# EAGLE design EEGFrontOnly (EAGLE 8.6.0)

## Sheet 1 of 2
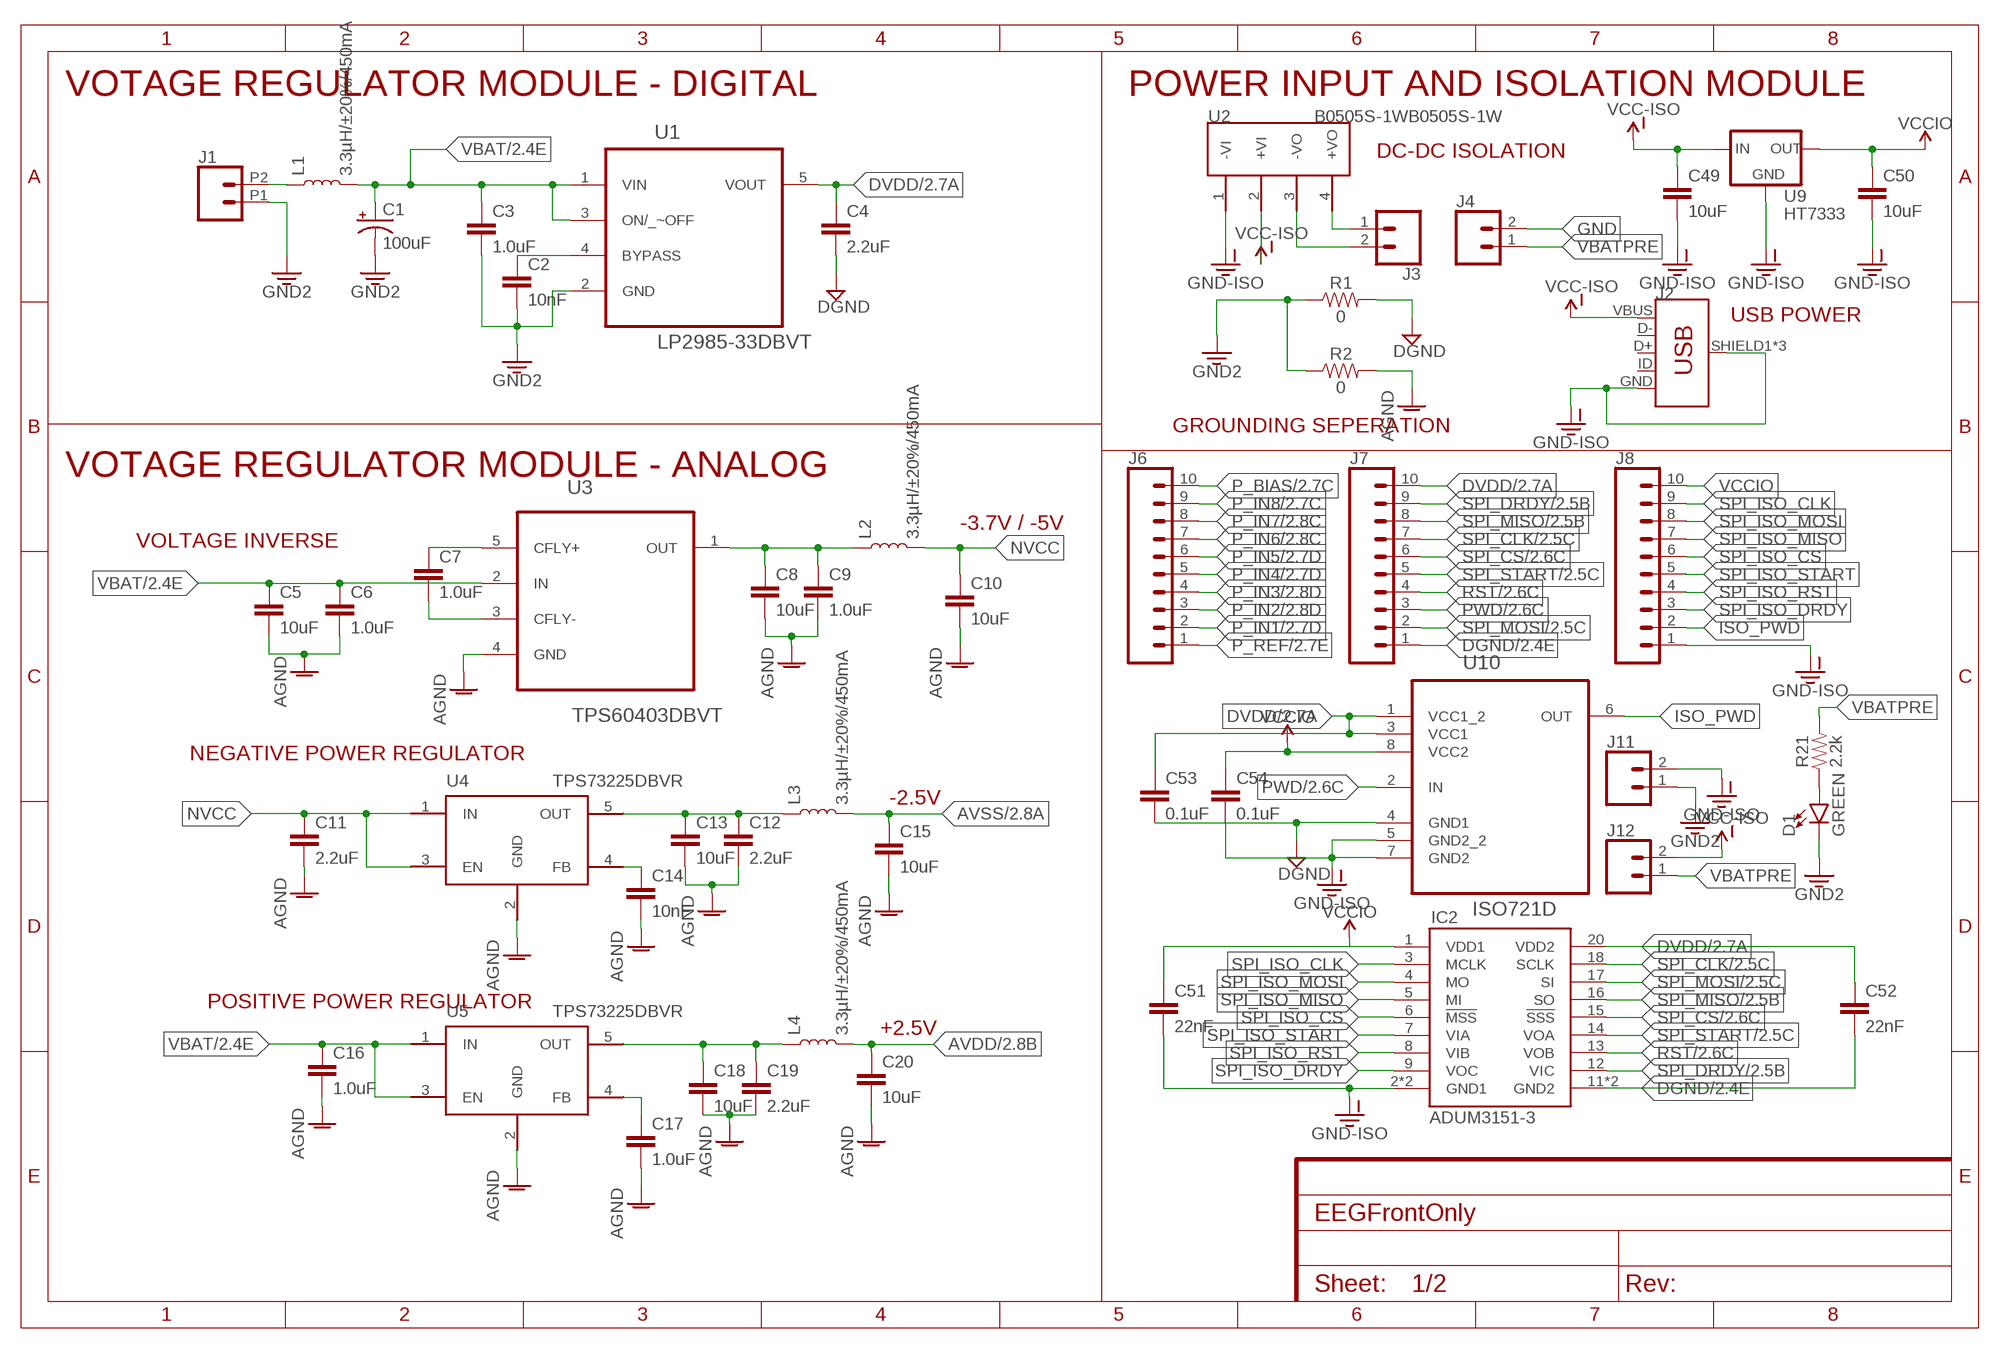
[diagram p0: schematic, sheet 1]

### Parts
C1  100uF  100UF-POLAR-RADIAL-2.5MM-25V-20%  [CPOL-RADIAL-2.5MM-6.5MM]
C2  10nF  10NF-0402-50V-10%  [0402]
C3  1.0uF  1.0UF-0402-16V-10%  [0402]
C4  2.2uF  2.2UF-0603-10V-20%  [0603]
C5  10uF  10UF-0603-6.3V-20%  [0603]
C6  1.0uF  1.0UF-0603-16V-10%  [0603]
C7  1.0uF  1.0UF-0402-16V-10%  [0402]
C8  10uF  10UF-0603-6.3V-20%  [0603]
C9  1.0uF  1.0UF-0603-16V-10%  [0603]
C10  10uF  10UF-0603-6.3V-20%  [0603]
C11  2.2uF  2.2UF-0603-10V-20%  [0603]
C12  2.2uF  2.2UF-0603-10V-20%  [0603]
C13  10uF  10UF-0603-6.3V-20%  [0603]
C14  10nF  10NF-0402-50V-10%  [0402]
C15  10uF  10UF-0603-6.3V-20%  [0603]
C16  1.0uF  1.0UF-0402-16V-10%  [0402]
C17  1.0uF  1.0UF-0402-16V-10%  [0402]
C18  10uF  10UF-0603-6.3V-20%  [0603]
C19  2.2uF  2.2UF-0603-10V-20%  [0603]
C20  10uF  10UF-0603-6.3V-20%  [0603]
C49  10uF  10UF-0603-6.3V-20%  [0603]
C50  10uF  10UF-0603-6.3V-20%  [0603]
C51  22nF  22NF/22,000PF-0402-50V-10%  [0402]
C52  22nF  22NF/22,000PF-0402-50V-10%  [0402]
C53  0.1uF  0.1UF-0402-16V-10%  [0402]
C54  0.1uF  0.1UF-0402-16V-10%  [0402]
D1  GREEN  LED-GREEN0603  [LED-0603]
IC2  ADUM3151-3  [SSOP20]
J1  CONN_022.54MM_SCREWTERM  [1X02_2.54_SCREWTERM]
J2  USB_MICRO-BREDUCED_PASTE  [USB-B-MICRO-SMD_RED_PASTE]
J3  CONN_02  [1X02]
J4  CONN_02  [1X02]
J6  CONN_10"  [1X10]
J7  CONN_10"  [1X10]
J8  CONN_10"  [1X10]
J11  CONN_02  [1X02]
J12  CONN_02  [1X02]
L1  3.3µH/±20%/450mA  INDUCTOR-0805-3.3UH  [0805]
L2  3.3µH/±20%/450mA  INDUCTOR-0805-3.3UH  [0805]
L3  3.3µH/±20%/450mA  INDUCTOR-0805-3.3UH  [0805]
L4  3.3µH/±20%/450mA  INDUCTOR-0805-3.3UH  [0805]
R1  0  560OHM_0402_1%  [0402]
R2  0  560OHM_0402_1%  [0402]
R21  2.2k  2.2KOHM-0603-1/10W-1%  [0603]
U1  LP2985-33DBVT  [SOT95P280X145-5N]
U2  B0505S-1WB0505S-1W  [DIP4]
U3  TPS60403DBVT  [SOT95P280X145-5N]
U4  TPS73225DBVR  [SOT95P280X145-5N]
U5  TPS73225DBVR  [SOT95P280X145-5N]
U9  HT7333  [SOT-89]
U10  ISO721D  [SOIC127P600X175-8N]

### Nets
AGND: C5.2 C6.2 C8.2 C9.2 C10.2 C11.2 C12.2 C13.2 C14.2 C15.2 C16.2 C17.2 C18.2 C19.2 C20.2 R2.2 U3.4(GND) U4.2(GND) U5.2(GND) ; also sheet 2
AVDD: C20.1 L4.2 ; also sheet 2
AVSS: C15.1 L3.2 ; also sheet 2
BYPASS: C2.1 U1.4(BYPASS)
DGND: C4.2 C52.2 C53.2 IC2.11(GND2) IC2.19(GND2) J7.1 R1.2 U10.4(GND1) ; also sheet 2
DVDD: C4.1 C52.1 C53.1 IC2.20(VDD2) J7.10 U1.5(VOUT) U10.1(VCC1_2) U10.3(VCC1) ; also sheet 2
GND: C1.2(-) C2.2 C3.2 D1.C J1.P1 J4.2 J11.1 R1.1 R2.1 U1.2(GND) ; supply symbol labelled GND2
GND-ISO: C49.2 C50.2 C51.2 C54.2 IC2.2(GND1) IC2.10(GND1) J2.GND J2.SHIELD1(SHIELD) J2.SHIELD2(SHIELD) J2.SHIELD3(SHIELD) J8.1 J11.2 U2.1(-VI) U9.2(GND) U10.5(GND2_2) U10.7(GND2)
ISO_PWD: J8.2 U10.6(OUT)
N$1: J3.1 U2.4(+VO)
N$2: J3.2 U2.3(-VO)
N$3: C7.1 U3.5(CFLY+)
N$4: C7.2 U3.3(CFLY-)
N$5: C8.1 C9.1 L2.1 U3.1(OUT)
N$6: C17.1 U5.4(FB)
N$7: C12.1 C13.1 L3.1 U4.5(OUT)
N$8: C14.1 U4.4(FB)
N$9: C18.1 C19.1 L4.1 U5.5(OUT)
N$27: D1.A R21.1
NVCC: C10.1 C11.1 L2.2 U4.1(IN) U4.3(EN)
P_BIAS: J6.10 ; also sheet 2
P_IN1: J6.2 ; also sheet 2
P_IN2: J6.3 ; also sheet 2
P_IN3: J6.4 ; also sheet 2
P_IN4: J6.5 ; also sheet 2
P_IN5: J6.6 ; also sheet 2
P_IN6: J6.7 ; also sheet 2
P_IN7: J6.8 ; also sheet 2
P_IN8: J6.9 ; also sheet 2
P_REF: J6.1 ; also sheet 2
PWD: J7.3 U10.2(IN) ; also sheet 2
RST: IC2.13(VOB) J7.4 ; also sheet 2
SPI_CLK: IC2.18(SCLK) J7.7 ; also sheet 2
SPI_CS: IC2.15(!SSS) J7.6 ; also sheet 2
SPI_DRDY: IC2.12(VIC) J7.9 ; also sheet 2
SPI_ISO_CLK: IC2.3(MCLK) J8.9
SPI_ISO_CS: IC2.6(!MSS) J8.6
SPI_ISO_DRDY: IC2.9(VOC) J8.3
SPI_ISO_MISO: IC2.5(MI) J8.7
SPI_ISO_MOSI: IC2.4(MO) J8.8
SPI_ISO_RST: IC2.8(VIB) J8.4
SPI_ISO_START: IC2.7(VIA) J8.5
SPI_MISO: IC2.16(SO) J7.8 ; also sheet 2
SPI_MOSI: IC2.17(SI) J7.2 ; also sheet 2
SPI_START: IC2.14(VOA) J7.5 ; also sheet 2
VBAT: C1.1(+) C3.1 C5.1 C6.1 C16.1 L1.2 U1.1(VIN) U1.3(ON/_~OFF) U3.2(IN) U5.1(IN) U5.3(EN) ; also sheet 2
VBATPRE: J1.P2 J4.1 J12.1 L1.1 R21.2
VCC-ISO: C49.1 J2.VBUS J12.2 U2.2(+VI) U9.3(IN) U9.4(IN)
VCCIO: C50.1 C51.1 C54.1 IC2.1(VDD1) J8.10 U9.1(OUT) U10.8(VCC2)
Unconnected: J2.D+ J2.D- J2.ID

### Notes on the sheet
- VOTAGE REGULATOR MODULE - DIGITAL | POWER INPUT AND ISOLATION MODULE
- DC-DC ISOLATION
- USB POWER
- GROUNDING SEPERATION
- VOTAGE REGULATOR MODULE - ANALOG
- -3.7V / -5V
- VOLTAGE INVERSE
- NEGATIVE POWER REGULATOR
- -2.5V
- POSITIVE POWER REGULATOR
- +2.5V

## Sheet 2 of 2
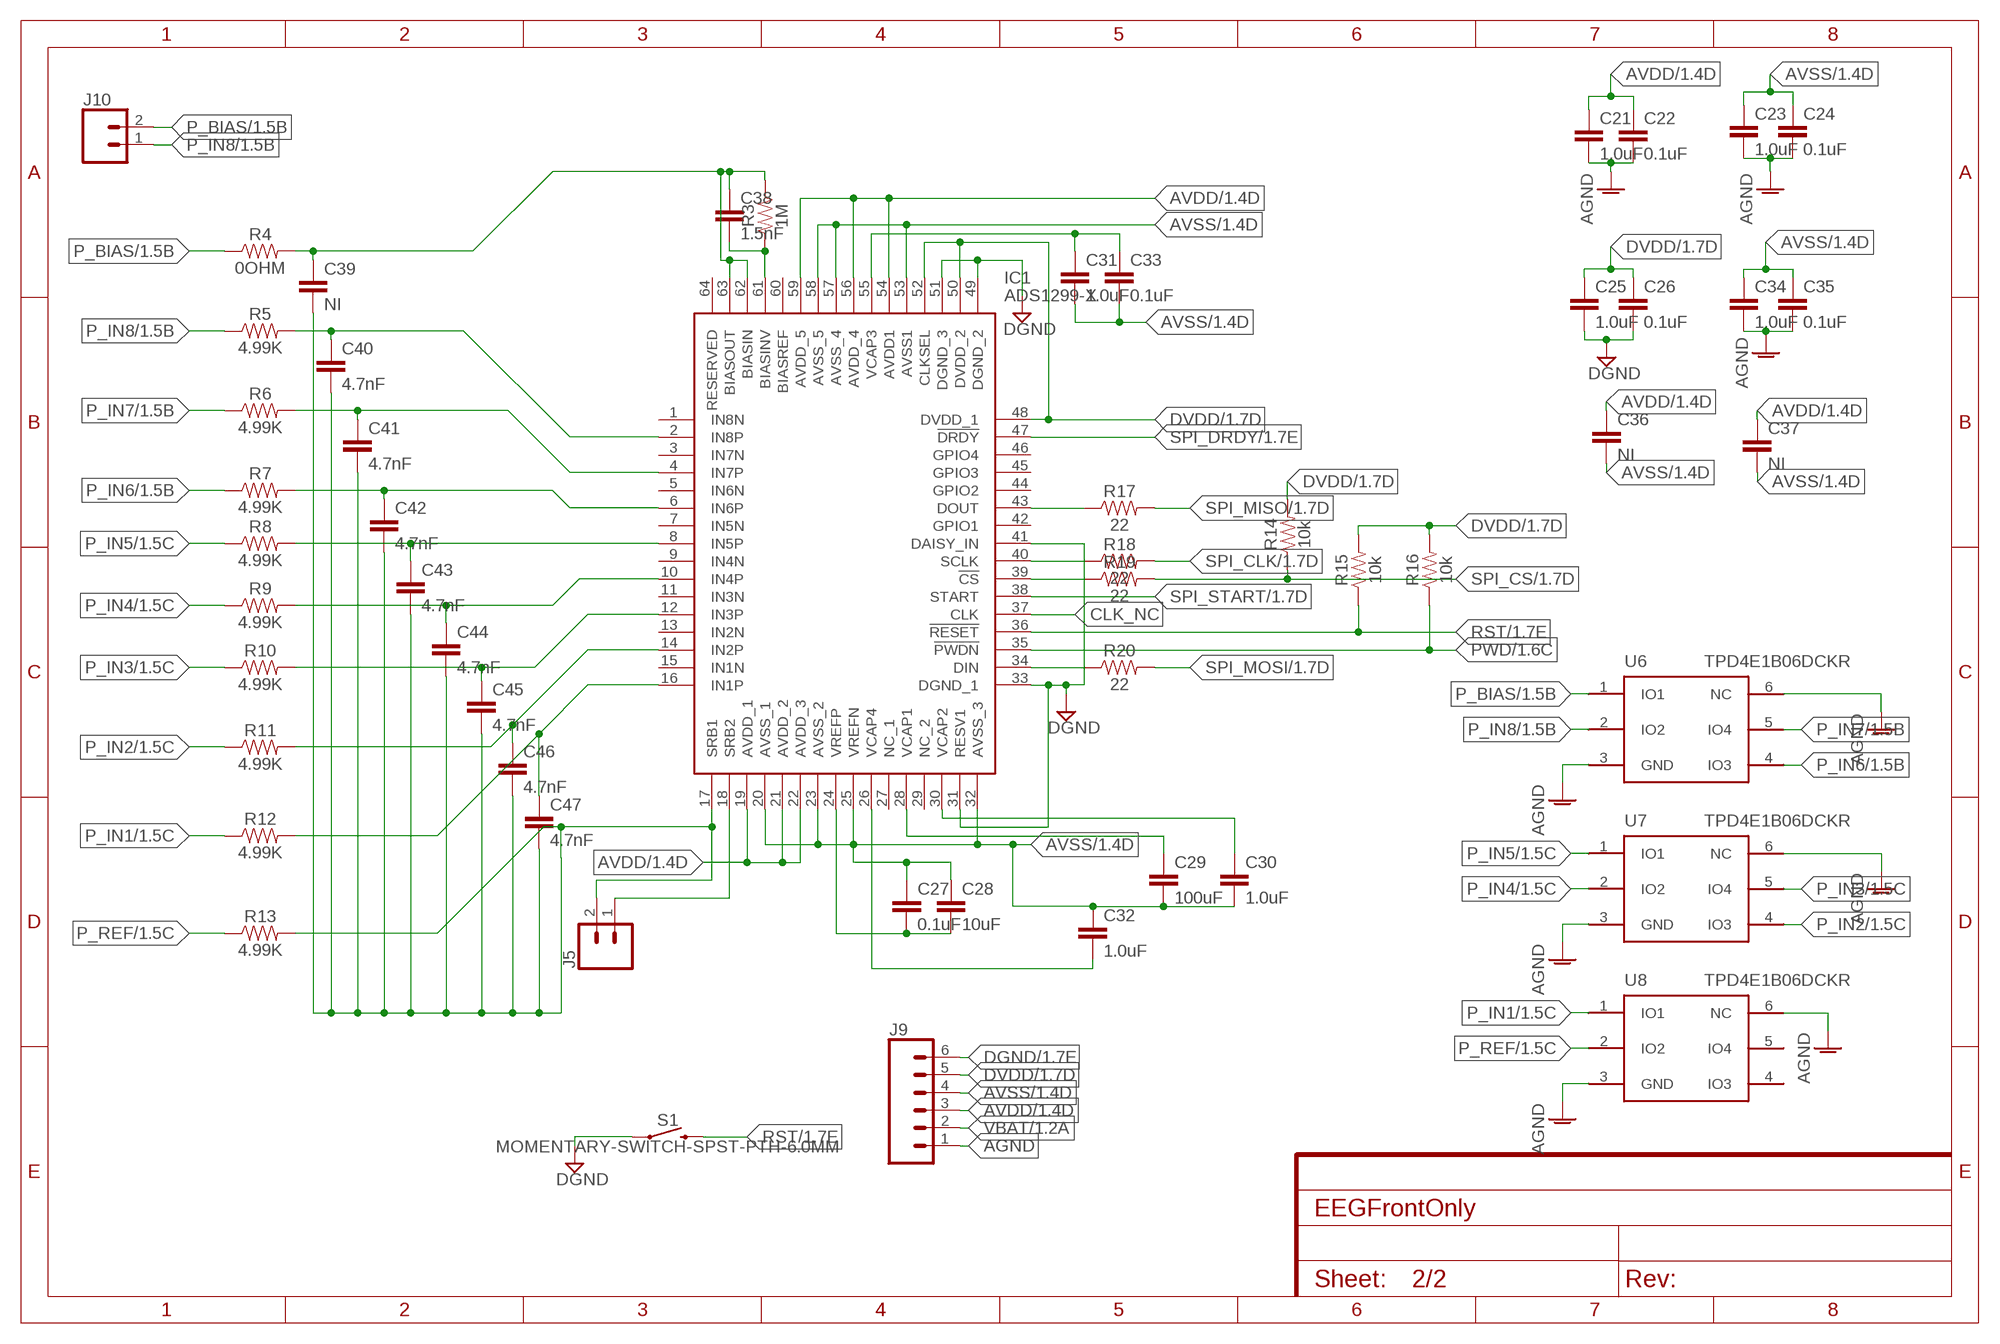
[diagram p1: schematic, sheet 2]

### Parts
C21  1.0uF  1.0UF-0402-16V-10%  [0402]
C22  0.1uF  0.1UF-0402-16V-10%  [0402]
C23  1.0uF  1.0UF-0402-16V-10%  [0402]
C24  0.1uF  0.1UF-0402-16V-10%  [0402]
C25  1.0uF  1.0UF-0402-16V-10%  [0402]
C26  0.1uF  0.1UF-0402-16V-10%  [0402]
C27  0.1uF  0.1UF-0402-16V-10%  [0402]
C28  10uF  10UF-0402-6.3V-20%  [0402]
C29  100uF  100UF-1210-20%-10V  [1210]
C30  1.0uF  1.0UF-0402-16V-10%  [0402]
C31  1.0uF  1.0UF-0402-16V-10%  [0402]
C32  1.0uF  1.0UF-0402-16V-10%  [0402]
C33  0.1uF  0.1UF-0402-16V-10%  [0402]
C34  1.0uF  1.0UF-0402-16V-10%  [0402]
C35  0.1uF  0.1UF-0402-16V-10%  [0402]
C36  NI  0.1UF-0402-16V-10%  [0402]
C37  NI  0.1UF-0402-16V-10%  [0402]
C38  1.5nF  1.5NF-0402  [0402]
C39  NI  4.7NF-0402  [0402]
C40  4.7nF  4.7NF-0402  [0402]
C41  4.7nF  4.7NF-0402  [0402]
C42  4.7nF  4.7NF-0402  [0402]
C43  4.7nF  4.7NF-0402  [0402]
C44  4.7nF  4.7NF-0402  [0402]
C45  4.7nF  4.7NF-0402  [0402]
C46  4.7nF  4.7NF-0402  [0402]
C47  4.7nF  4.7NF-0402  [0402]
IC1  ADS1299-X  [QFP50P1200X1200X120-64N]
J5  CONN_02  [1X02]
J9  CONN_06SILK_FEMALE_PTH  [1X06]
J10  CONN_02  [1X02]
R3  1M  1MOHM-0402-1/4W-5%  [0402]
R4  0OHM  [0402]
R5  4.99K  4.99KOHM-0402  [0402]
R6  4.99K  4.99KOHM-0402  [0402]
R7  4.99K  4.99KOHM-0402  [0402]
R8  4.99K  4.99KOHM-0402  [0402]
R9  4.99K  4.99KOHM-0402  [0402]
R10  4.99K  4.99KOHM-0402  [0402]
R11  4.99K  4.99KOHM-0402  [0402]
R12  4.99K  4.99KOHM-0402  [0402]
R13  4.99K  4.99KOHM-0402  [0402]
R14  10k  10KOHM-0402-1/10W-1%  [0402]
R15  10k  10KOHM-0402-1/10W-1%  [0402]
R16  10k  10KOHM-0402-1/10W-1%  [0402]
R17  22  22OHM-0402-1/10W-1%  [0402]
R18  22  22OHM-0402-1/10W-1%  [0402]
R19  22  22OHM-0402-1/10W-1%  [0402]
R20  22  22OHM-0402-1/10W-1%  [0402]
S1  MOMENTARY-SWITCH-SPST-PTH-6.0MM  [TACTILE_SWITCH_PTH_6.0MM]
U6  TPD4E1B06DCKR  [SC70-6]
U7  TPD4E1B06DCKR  [SC70-6]
U8  TPD4E1B06DCKR  [SC70-6]

### Nets
AGND: C21.2 C22.2 C23.2 C24.2 C34.2 C35.2 J9.1 U6.3(GND) U6.6(NC) U7.3(GND) U7.6(NC) U8.3(GND) U8.6(NC) ; also sheet 1
AVDD: C21.1 C22.1 C36.1 C37.1 IC1.19(AVDD_1) IC1.21(AVDD_2) IC1.22(AVDD_3) IC1.54(AVDD1) IC1.56(AVDD_4) IC1.59(AVDD_5) J9.3 ; also sheet 1
AVSS: C23.1 C24.1 C27.1 C28.1 C29.2 C30.2 C31.2 C32.1 C33.2 C34.1 C35.1 C36.2 C37.2 IC1.20(AVSS_1) IC1.23(AVSS_2) IC1.25(VREFN) IC1.32(AVSS_3) IC1.53(AVSS1) IC1.57(AVSS_4) IC1.58(AVSS_5) J9.4 ; also sheet 1
CLK_NC: IC1.37(CLK)
DGND: C25.2 C26.2 IC1.31(RESV1) IC1.33(DGND_1) IC1.41(DAISY_IN) IC1.49(DGND_2) IC1.51(DGND_3) J9.6 S1.1 ; also sheet 1
DVDD: C25.1 C26.1 IC1.48(DVDD_1) IC1.50(DVDD_2) IC1.52(CLKSEL) J9.5 R14.2 R15.2 R16.2 ; also sheet 1
N$10: C27.2 C28.2 IC1.24(VREFP)
N$11: IC1.18(SRB2) J5.1
N$12: C39.2 C40.2 C41.2 C42.2 C43.2 C44.2 C45.2 C46.2 C47.2 IC1.17(SRB1) J5.2 R13.2
N$13: C38.2 IC1.61(BIASINV) R3.1
N$14: C38.1 C39.1 IC1.62(BIASIN) IC1.63(BIASOUT) R3.2 R4.2
N$15: C40.1 IC1.2(IN8P) R5.2
N$16: C41.1 IC1.4(IN7P) R6.2
N$17: C42.1 IC1.6(IN6P) R7.2
N$18: C43.1 IC1.8(IN5P) R8.2
N$19: C44.1 IC1.10(IN4P) R9.2
N$20: C45.1 IC1.12(IN3P) R10.2
N$21: C46.1 IC1.14(IN2P) R11.2
N$22: C47.1 IC1.16(IN1P) R12.2
N$23: IC1.43(DOUT) R17.1
N$24: IC1.40(SCLK) R18.1
N$25: IC1.39(!CS) R19.1
N$26: IC1.34(DIN) R20.1
P_BIAS: J10.2 R4.1 U6.1(IO1) ; also sheet 1
P_IN1: R12.1 U8.1(IO1) ; also sheet 1
P_IN2: R11.1 U7.4(IO3) ; also sheet 1
P_IN3: R10.1 U7.5(IO4) ; also sheet 1
P_IN4: R9.1 U7.2(IO2) ; also sheet 1
P_IN5: R8.1 U7.1(IO1) ; also sheet 1
P_IN6: R7.1 U6.4(IO3) ; also sheet 1
P_IN7: R6.1 U6.5(IO4) ; also sheet 1
P_IN8: J10.1 R5.1 U6.2(IO2) ; also sheet 1
P_REF: R13.1 U8.2(IO2) ; also sheet 1
PWD: IC1.35(!PWDN) R16.1 ; also sheet 1
RST: IC1.36(!RESET) R15.1 S1.3 ; also sheet 1
SPI_CLK: R18.2 ; also sheet 1
SPI_CS: R14.1 R19.2 ; also sheet 1
SPI_DRDY: IC1.47(!DRDY) ; also sheet 1
SPI_MISO: R17.2 ; also sheet 1
SPI_MOSI: R20.2 ; also sheet 1
SPI_START: IC1.38(START) ; also sheet 1
VBAT: J9.2 ; also sheet 1
VCAP1: C29.1 IC1.28(VCAP1)
VCAP2: C30.1 IC1.30(VCAP2)
VCAP3: C31.1 C33.1 IC1.55(VCAP3)
VCAP4: C32.2 IC1.26(VCAP4)
Unconnected: IC1.1(IN8N) IC1.3(IN7N) IC1.5(IN6N) IC1.7(IN5N) IC1.9(IN4N) IC1.11(IN3N) IC1.13(IN2N) IC1.15(IN1N) IC1.27(NC_1) IC1.29(NC_2) IC1.42(GPIO1) IC1.44(GPIO2) IC1.45(GPIO3) IC1.46(GPIO4) IC1.60(BIASREF) IC1.64(RESERVED) U8.4(IO3) U8.5(IO4)

## Library data of the parts
C1 = SparkFun-Capacitors:100UF-POLAR: 100µF polarized capacitors A capacitor is a passive two-terminal electrical component used to store electrical energy temporarily in an electric field.; PROD_ID: CAP-08439
C2 C14 = SparkFun-Capacitors:10NF: 0.01uF/10nF/10,000pF ceramic capacitors A capacitor is a passive two-terminal electrical component used to store electrical energy temporarily in an electric field. CAP-09321
C3 C7 C16 C17 C21 C23 C25 C30-C32 C34 = SparkFun-Capacitors:1.0UF: 1µF ceramic capacitors A capacitor is a passive two-terminal electrical component used to store electrical energy temporarily in an electric field.; PROD_ID: CAP-12417
C4 C11 C12 C19 = SparkFun-Capacitors:2.2UF: 2.2µF ceramic capacitors A capacitor is a passive two-terminal electrical component used to store electrical energy temporarily in an electric field.; PROD_ID: CAP-07888
C5 C8 C10 C13 C15 C18 C20 C49 C50 = SparkFun-Capacitors:10UF: 10.0µF ceramic capacitors A capacitor is a passive two-terminal electrical component used to store electrical energy temporarily in an electric field.; PROD_ID: CAP-11015
C6 C9 = SparkFun-Capacitors:1.0UF: 1µF ceramic capacitors A capacitor is a passive two-terminal electrical component used to store electrical energy temporarily in an electric field.; PROD_ID: CAP-00868
C22 C24 C26 C27 C33 C35 C53 C54 = SparkFun-Capacitors:0.1UF: 0.1µF ceramic capacitors A capacitor is a passive two-terminal electrical component used to store electrical energy temporarily in an electric field.; PROD_ID: CAP-12416
C28 = SparkFun-Capacitors:10UF: 10.0µF ceramic capacitors A capacitor is a passive two-terminal electrical component used to store electrical energy temporarily in an electric field.
C29 = jingjieparts:100UF
C36 C37 = SparkFun-Capacitors:0.1UF: 0.1µF ceramic capacitors A capacitor is a passive two-terminal electrical component used to store electrical energy temporarily in an electric field.; PROD_ID: CAP-12416; VALUE: 0.1uF
C38 = SparkFun-Capacitors:1.5NF
C39 = SparkFun-Capacitors:4.7NF; VALUE: 4.7nF
C40-C47 = SparkFun-Capacitors:4.7NF
C51 C52 = SparkFun-Capacitors:22NF/22,000PF: 0.022uF/22nF/22,000pF ceramic capacitors A capacitor is a passive two-terminal electrical component used to store electrical energy temporarily in an electric field.; PROD_ID: C337699
D1 = SparkFun-LED:LED-GREEN: Green SMD LED Used in manufacturing of various products at SparkFun Packages: 0603 - SMD 0603 package [Product Link] <http://www.futureelectronics.com/en/technologies/semiconductors/optoelectronics/leds/Pages/9894312-LTST-C190GKT.aspx?CrossPart=HSMG-C190&IM=0> LilyPad 1206 - SMD1206 LilyPad package [Product Link] <http://www.futureelectronics.com/en/Technologies/Product.aspx?ProductID=IN150NGHARVATEKCORPORATION2049943&IM=0> 1206 - SMD1206 package [Product Link] <http://www.futureelectronics.com/en/technologies/semiconductors/optoelectronics/leds/Pages/8315665-LTST-C150KGKT.aspx?IM=0> 1206 Bottom Mount -SMD 1206 Bottom Mount [Product Link] <http://www.digikey.com/product-detail/en/lite-on-inc/LTST-C230KGKT/160-1456-1-ND/386854> SparkFun Products: Pro Mini 328 -5V <https://www.sparkfun.com/products/821> RedBoard <https://www.sparkfun.com/products/12757> MP3 Trigger <https://www.sparkfun.com/products/13720> Makey Makey <https://www.sparkfun.com/products/11076>; PROD_ID: DIO-00821
IC1 = ADS1299-X:ADS1299-X: ADS1299-x 24-Bit Analog-to-Digital Converters (ADCs) Source: Datasheet <http://www.ti.com/lit/ds/symlink/ads1299.pdf>; DESCRIPTION: ADS1299-x 24-Bit Analog-to-Digital Converters (ADCs); HEIGHT: 1.2mm; MANUFACTURER_NAME: Texas Instruments; MANUFACTURER_PART_NUMBER: ADS1299-X
IC2 = analog-devices-adum315x:ADUM3151-3: The ADuM3151/ADuM3152/ADuM3153are 7-channel, SPIsolator™ digital isolators optimized for isolated serial peripheral interfaces (SPIs). Based on the Analog Devices, Inc., iCoupler® chip scale transformer technology, the low propagation delay in the CLK, MO/SI, MI/SO, and SSSPI bus signals supports SPI clock rates of up to 17 MHz. These channels operate with 14 ns propagation delay and 1 ns jitter to optimize timing for SPI. The library has been designed by Richard Magdycz <https://www.facebook.com/groups/eaglecadsoftUK>
J1 J3-J5 J10-J12 = SparkFun-Connectors:CONN_02: Multi connection point. Often used as Generic Header-pin footprint for 0.1 inch spaced/style header connections On any of the 0.1 inch spaced packages, you can populate with these: Break Away Headers - Straight <https://www.sparkfun.com/products/116> (PRT-00116) Break Away Male Headers - Right Angle <https://www.sparkfun.com/products/553> (PRT-00553) Female Headers <https://www.sparkfun.com/products/115> (PRT-00115) Break Away Headers - Machine Pin <https://www.sparkfun.com/products/117> (PRT-00117) Break Away Female Headers - Swiss Machine Pin <https://www.sparkfun.com/products/743> (PRT-00743) For SCREWTERMINALS and SPRING TERMINALS visit here: Screw Terimnals on SparkFun.com <https://www.sparkfun.com/search/results?term=Screw+Terminals> (5mm/3.5mm/2.54mm spacing) This device is also useful as a general connection point to wire up your design to another part of your project. Our various solder wires solder well into these plated through hole pads. Hook-Up Wire - Assortment (Stranded, 22 AWG) <https://www.sparkfun.com/products/11375> (PRT-11375) Hook-Up Wire - Assortment (Solid Core, 22 AWG) <https://www.sparkfun.com/products/11367> (PRT-11367) View the entire wire category on our website here <https://www.sparkfun.com/categories/141> Special notes: Molex polarized connector foot print use with: PRT-08233 with associated crimp pins and housings. 2.54_SCREWTERM for use with PRT-10571. 3.5mm Screw Terminal footprints for PRT-08084 5mm Screw Terminal footprints for use with PRT-08432
J2 = SparkFun-Connectors:USB_MICRO-B: USB Type Micro-B Connector Male/female and PTH/SMT variants SparkFun Products: SparkFun microB USB Breakout <https://www.sparkfun.com/products/12035> SparkFun USB microB Plug Breakout <https://www.sparkfun.com/products/10031> SparkFun ESP8266 Thing <https://www.sparkfun.com/products/13231>; PROD_ID: CONN-11752
J6-J8 = SparkFun-Connectors:CONN_10: Multi connection point. Often used as Generic Header-pin footprint for 0.1 inch spaced/style header connections On any of the 0.1 inch spaced packages, you can populate with these: Break Away Headers - Straight <https://www.sparkfun.com/products/116> (PRT-00116) Break Away Male Headers - Right Angle <https://www.sparkfun.com/products/553> (PRT-00553) Female Headers <https://www.sparkfun.com/products/115> (PRT-00115) Break Away Headers - Machine Pin <https://www.sparkfun.com/products/117> (PRT-00117) Break Away Female Headers - Swiss Machine Pin <https://www.sparkfun.com/products/743> (PRT-00743) Arduino Stackable Header - 10 Pin <https://www.sparkfun.com/products/11376> (PRT-11376) For SCREWTERMINALS and SPRING TERMINALS visit here: Screw Terimnals on SparkFun.com <https://www.sparkfun.com/search/results?term=Screw+Terminals> (5mm/3.5mm/2.54mm spacing) This device is also useful as a general connection point to wire up your design to another part of your project. Our various solder wires solder well into these plated through hole pads. Hook-Up Wire - Assortment (Stranded, 22 AWG) <https://www.sparkfun.com/products/11375> (PRT-11375) Hook-Up Wire - Assortment (Solid Core, 22 AWG) <https://www.sparkfun.com/products/11367> (PRT-11367) View the entire wire category on our website here <https://www.sparkfun.com/categories/141> Special notes: Molex polarized connector foot print use with SKU : PRT-08231 with associated crimp pins and housings. 1MM SMD Version SKU: PRT-10208 NOTES ON THE VARIANTS LOCK and LOCK_LONGPADS... This footprint was designed to help hold the alignment of a through-hole component (i.e. 6-pin header) while soldering it into place. You may notice that each hole has been shifted either up or down by 0.005 of an inch from it's more standard position (which is a perfectly straight line). This slight alteration caused the pins (the squares in the middle) to touch the edges of the holes. Because they are alternating, it causes a "brace" to hold the component in place. 0.005 has proven to be the perfect amount of "off-center" position when using our standard breakaway headers. Although looks a little odd when you look at the bare footprint, once you have a header in there, the alteration is very hard to notice. Also,if you push a header all the way into place, it is covered up entirely on the bottom side.; PROD_ID: CONN-11563
J9 = SparkFun-Connectors:CONN_06: Multi connection point. Often used as Generic Header-pin footprint for 0.1 inch spaced/style header connections On any of the 0.1 inch spaced packages, you can populate with these: Break Away Headers - Straight <https://www.sparkfun.com/products/116> (PRT-00116) Break Away Male Headers - Right Angle <https://www.sparkfun.com/products/553> (PRT-00553) Female Headers <https://www.sparkfun.com/products/115> (PRT-00115) Break Away Headers - Machine Pin <https://www.sparkfun.com/products/117> (PRT-00117) Break Away Female Headers - Swiss Machine Pin <https://www.sparkfun.com/products/743> (PRT-00743) Arduino Stackable Header - 6 Pin <https://www.sparkfun.com/products/9280> (PRT-09280) For SCREWTERMINALS and SPRING TERMINALS visit here: Screw Terimnals on SparkFun.com <https://www.sparkfun.com/search/results?term=Screw+Terminals> (5mm/3.5mm/2.54mm spacing) This device is also useful as a general connection point to wire up your design to another part of your project. Our various solder wires solder well into these plated through hole pads. Hook-Up Wire - Assortment (Stranded, 22 AWG) <https://www.sparkfun.com/products/11375> (PRT-11375) Hook-Up Wire - Assortment (Solid Core, 22 AWG) <https://www.sparkfun.com/products/11367> (PRT-11367) View the entire wire category on our website here <https://www.sparkfun.com/categories/141>; PROD_ID: CONN-08437
L1-L4 = SparkFun-Coils:INDUCTOR: Inductors Resist changes in electrical current. Basically a coil of wire. SparkFun Products: SparkFun Load Cell Amplifier - HX711 <https://www.sparkfun.com/products/13879> IOIO-OTG - V2.2 <https://www.sparkfun.com/products/13613>; PROD_ID: NDUC-13076
R1 R2 = SparkFun-Resistors:560OHM; PROD_ID: RES-13766; VALUE: 560
R3 = SparkFun-Resistors:1MOHM: 1MΩ resistor A resistor is a passive two-terminal electrical component that implements electrical resistance as a circuit element. Resistors act to reduce current flow, and, at the same time, act to lower voltage levels within circuits. - Wikipedia; PROD_ID: C26083
R4 = SparkFun-Resistors:0OHM: 0Ω resistor A resistor is a passive two-terminal electrical component that implements electrical resistance as a circuit element. Resistors act to reduce current flow, and, at the same time, act to lower voltage levels within circuits. - Wikipedia
R5-R13 = SparkFun-Resistors:4.99KOHM
R14-R16 = SparkFun-Resistors:10KOHM: 10kΩ resistor A resistor is a passive two-terminal electrical component that implements electrical resistance as a circuit element. Resistors act to reduce current flow, and, at the same time, act to lower voltage levels within circuits. - Wikipedia
R17-R20 = SparkFun-Resistors:22OHM: 22Ω resistor A resistor is a passive two-terminal electrical component that implements electrical resistance as a circuit element. Resistors act to reduce current flow, and, at the same time, act to lower voltage levels within circuits. - Wikipedia; PROD_ID: RES-12427
R21 = SparkFun-Resistors:2.2KOHM: 2.2kΩ resistor A resistor is a passive two-terminal electrical component that implements electrical resistance as a circuit element. Resistors act to reduce current flow, and, at the same time, act to lower voltage levels within circuits. - Wikipedia; PROD_ID: RES-08272
S1 = SparkFun-Switches:MOMENTARY-SWITCH-SPST: Momentary Switch (Pushbutton) - SPST Normally-open (NO) SPST momentary switches (buttons, pushbuttons). Variants PTH-12MM - 12mm square, through-hole Momentary Pushbutton Switch - 12mm Square <https://www.sparkfun.com/products/9190> (COM-09190) PTH-6.0MM, PTH-6.0MM-KIT - 6.0mm square, through-hole Mini Pushbutton Switch <https://www.sparkfun.com/products/97> (COM-00097) KIT package intended for soldering kit's - only one side of pads' copper is exposed. PTH-RIGHT-ANGLE-KIT - Right-angle, through-hole Right Angle Tactile Button <https://www.sparkfun.com/products/10791> - Used on SparkFun BigTime Watch Kit <https://www.sparkfun.com/products/11734> SMD-12MM - 12mm square, surface-mount Tactile Button - SMD (12mm) <https://www.sparkfun.com/products/12993> (COM-12993) Used on SparkFun PicoBoard <https://www.sparkfun.com/products/11888> SMD-4.5MM - 4.5mm Square Trackball Switch Used on SparkFun Blackberry Trackballer Breakout <https://www.sparkfun.com/products/13169> SMD-4.6MMX2.8MM - 4.60mm x 2.80mm, surface mount Used on SparkFun SAMD21 Mini Breakout <https://www.sparkfun.com/products/13664> SMD-5.2MM, SMD-5.2-REDUNDANT - 5.2mm square, surface-mount Mini Pushbutton Switch - SMD <https://www.sparkfun.com/products/8720> (COM-08720) Used on Arduino Pro Mini <https://www.sparkfun.com/products/11114> REDUNDANT package connects both switch circuits together SMD-6.0X3.5MM - 6.0 x 3.5mm, surface mount Momentary Reset Switch SMD <https://www.sparkfun.com/products/8229> (COM-08229) SMD-6.2MM-TALL - 6.2mm square, surface mount Tactile Button - SMD (6mm) <https://www.sparkfun.com/products/12992> Used on SparkFun Digital Sandbox <https://www.sparkfun.com/products/12651> SMD-RIGHT-ANGLE - Right-angle, surface mount Used on SparkFun Block for Intel® Edison - Arduino <https://www.sparkfun.com/products/13036>; PROD_ID: SWCH-08441; SF_SKU: COM-00097
U1 = Texas Instruments_By_element14_Batch_1:LP2985-33DBVT: 150-mA LOW-NOISE LOW-DROPOUT REGULATOR WITH SHUTDOWN; MPN: LP2985-33DBVT; OC_FARNELL: -; OC_NEWARK: 43J9347; PACKAGE: SOT-23-5; SUPPLIER: Texas Instruments
U2 = jingjieparts:B0505S-1W
U3 = Texas Instruments_By_element14_Batch_1:TPS60403DBVT: Unregulated 60 mA Charge pump voltage Inverter; MPN: TPS60403DBVT; OC_FARNELL: 8457786; OC_NEWARK: 77C0632; PACKAGE: SOT-23-5; SUPPLIER: Texas Instruments
U4 U5 = jingjieparts:TPS73225
U6-U8 = jingjieparts:TPD4E1B06
U9 = holtek2:HT73*
U10 = Texas Instruments_By_element14_Batch_1:ISO721D: 3.3-V / 5-V HIGH-SPEED DIGITAL ISOLATORS; MPN: ISO721D; OC_FARNELL: -; OC_NEWARK: 74K5333; PACKAGE: SOIC-8; SUPPLIER: Texas Instruments

## Board
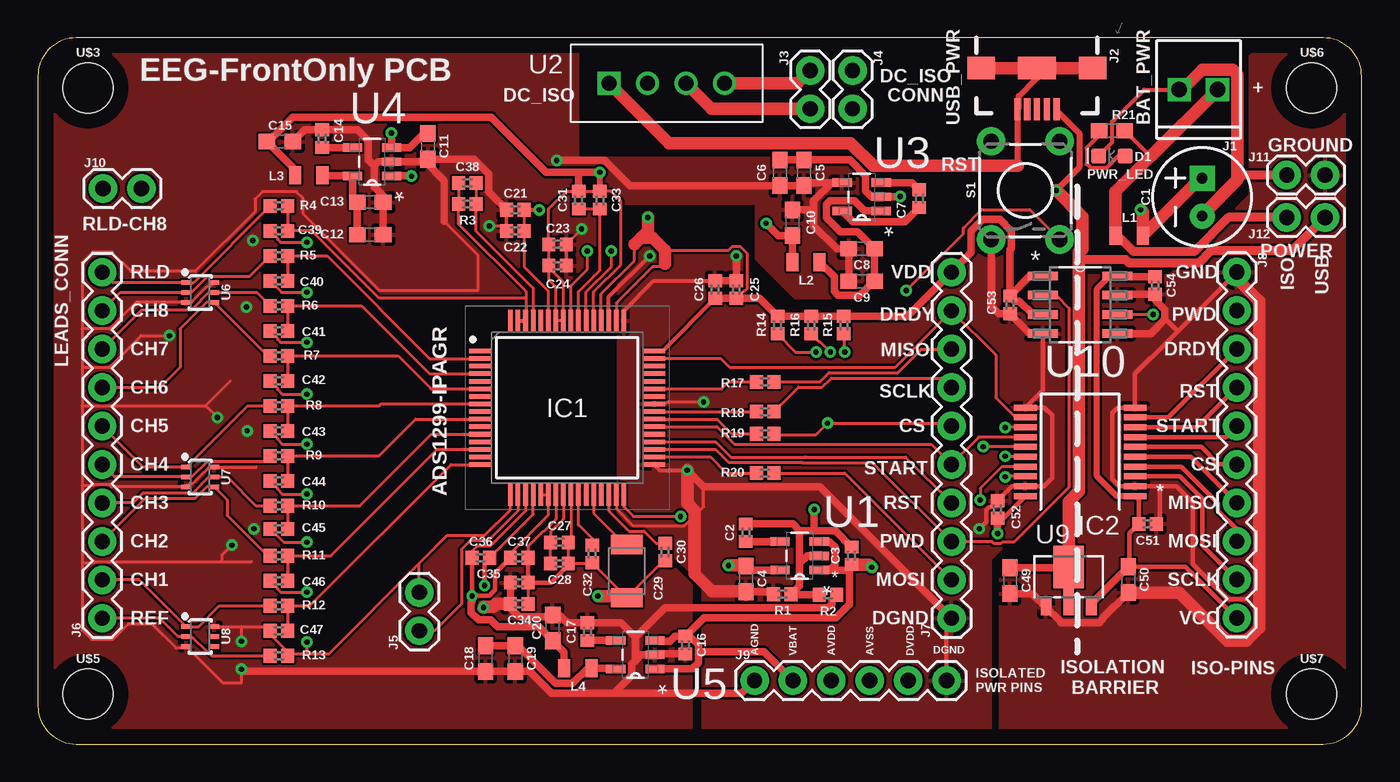
[diagram p2: board, top side]
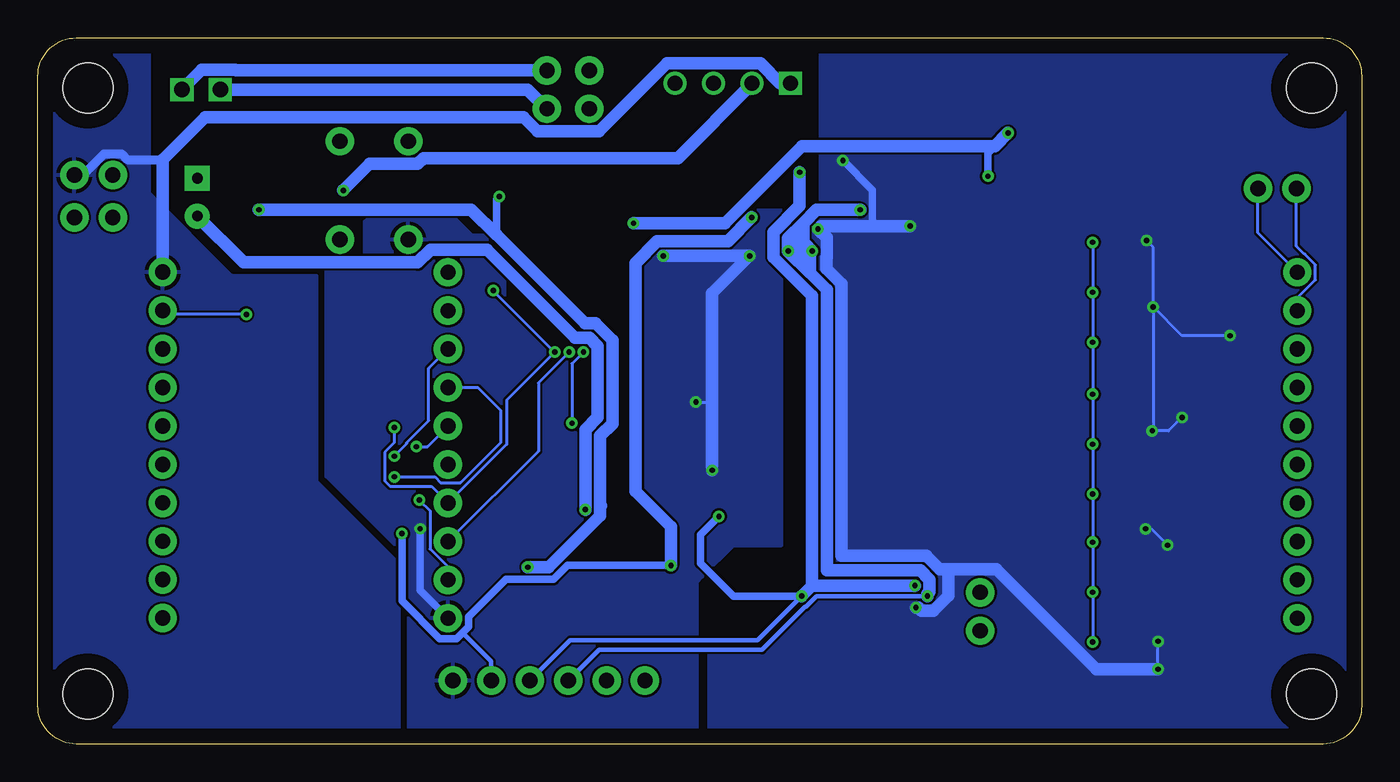
[diagram p3: board, bottom side, seen from below]

Size 87.5 x 46.66 mm. Coordinates in mm from the lower left corner, seen from the top.
Outline: 0,44.12 0,2.54 arc90 2.54,0 84.96,0 arc90 87.5,2.54 87.5,44.12 arc90 84.96,46.66 2.54,46.66 arc90 0,44.12
Copper layers (1*16): Top 0.035mm / dielectric 1.53mm / Bottom 0.035mm
Design rules "default *": minimum track width 6mil, minimum drill 0.35mm, track to track 6mil, track to pad 6mil, pad to pad 6mil, via to via 6mil, smd to smd 6mil, copper to edge 40mil, drill to drill 6mil, minimum pad ring 10mil, minimum via ring 8mil, stop-mask expansion 4mil, vias tented up to drill 0mil, thermal gap 10mil

### Footprints (pad centres in the part's own frame; a part is rotated, then mirrored left to right if it is on the bottom)
CPOL-RADIAL-2.5MM-6.5MM = drill 0.7 pad 1.651 square: 1 1.25,0 | drill 0.7 pad 1.651: 2 -1.25,0
0402 = smd 0.85 x 0.9: 1 -0.58,0; 2 0.58,0
0603 = smd 1.1 x 1: 1 -0.85,0; 2 0.85,0
1210 = smd 1.27 x 2.06: 1 -1.755,0; 2 1.755,0
LED-0603 = smd 1 x 1: A -0.877,0; C 0.877,0
QFP50P1200X1200X120-64N = smd 1.475 x 0.3: 1 -5.738,3.75; 2 -5.738,3.25; 3 -5.738,2.75; 4 -5.738,2.25; 5 -5.738,1.75; 6 -5.738,1.25; 7 -5.738,0.75; 8 -5.738,0.25; 9 -5.738,-0.25; 10 -5.738,-0.75; 11 -5.738,-1.25; 12 -5.738,-1.75; 13 -5.738,-2.25; 14 -5.738,-2.75; 15 -5.738,-3.25; 16 -5.738,-3.75; 33 5.738,-3.75; 34 5.738,-3.25; 35 5.738,-2.75; 36 5.738,-2.25; 37 5.738,-1.75; 38 5.738,-1.25; 39 5.738,-0.75; 40 5.738,-0.25; 41 5.738,0.25; 42 5.738,0.75; 43 5.738,1.25; 44 5.738,1.75; 45 5.738,2.25; 46 5.738,2.75; 47 5.738,3.25; 48 5.738,3.75 | smd 0.3 x 1.475: 17 -3.75,-5.738; 18 -3.25,-5.738; 19 -2.75,-5.738; 20 -2.25,-5.738; 21 -1.75,-5.738; 22 -1.25,-5.738; 23 -0.75,-5.738; 24 -0.25,-5.738; 25 0.25,-5.738; 26 0.75,-5.738; 27 1.25,-5.738; 28 1.75,-5.738; 29 2.25,-5.738; 30 2.75,-5.738; 31 3.25,-5.738; 32 3.75,-5.738; 49 3.75,5.738; 50 3.25,5.738; 51 2.75,5.738; 52 2.25,5.738; 53 1.75,5.738; 54 1.25,5.738; 55 0.75,5.738; 56 0.25,5.738; 57 -0.25,5.738; 58 -0.75,5.738; 59 -1.25,5.738; 60 -1.75,5.738; 61 -2.25,5.738; 62 -2.75,5.738; 63 -3.25,5.738; 64 -3.75,5.738
SSOP20 = smd 0.4 x 1.5: 1 -2.925,-3.625; 2 -2.275,-3.625; 3 -1.625,-3.625; 4 -0.975,-3.625; 5 -0.325,-3.625; 6 0.325,-3.625; 7 0.975,-3.625; 8 1.625,-3.625; 9 2.275,-3.625; 10 2.925,-3.625; 11 2.925,3.625; 12 2.275,3.625; 13 1.625,3.625; 14 0.975,3.625; 15 0.325,3.625; 16 -0.325,3.625; 17 -0.975,3.625; 18 -1.625,3.625; 19 -2.275,3.625; 20 -2.925,3.625
1X02_2.54_SCREWTERM = drill 1.016 square: P1 2.54,0; P2 0,0
USB-B-MICRO-SMD_RED_PASTE = smd 1.45 x 0.4: D+ 2.725,0; D- 2.725,0.65; GND 2.725,-1.3; ID 2.725,-0.65; VBUS 2.725,1.3 | smd 1.5 x 1.8: SHIELD1 0,3.685; SHIELD2 0,-3.685 | smd 1.5 x 2.5: SHIELD3 0,0
1X02 = drill 1.016 pad 1.88: 1 0,0; 2 2.54,0
1X10 = drill 1.016 pad 1.88: 1 0,0; 2 2.54,0; 3 5.08,0; 4 7.62,0; 5 10.16,0; 6 12.7,0; 7 15.24,0; 8 17.78,0; 9 20.32,0; 10 22.86,0
1X06 = drill 1.016 pad 1.88: 1 0,0; 2 2.54,0; 3 5.08,0; 4 7.62,0; 5 10.16,0; 6 12.7,0
0805 = smd 0.8 x 1.2: 1 -0.9,0; 2 0.9,0
TACTILE_SWITCH_PTH_6.0MM = drill 1.016 pad 1.88: 1 -3.251,2.261; 2 3.251,2.261; 3 -3.251,-2.261; 4 3.251,-2.261
SOT95P280X145-5N = smd 1.27 x 0.559: 1 -1.295,0.94; 2 -1.295,0; 3 -1.295,-0.94; 4 1.295,-0.94; 5 1.295,0.94
DIP4 = drill 1 square: 1 0,0 | drill 1: 2 2.54,0; 3 5.08,0; 4 7.62,0
SC70-6 = smd 0.3 x 0.66: 1 -0.65,-0.92; 2 0,-0.92; 3 0.65,-0.92; 4 0.65,0.92; 5 0,0.92; 6 -0.65,0.92
SOT-89 = smd 0.7 x 1.1: 1 1.5,-2.385; 2 -1.5,-2.385 | smd 0.7 x 1.8: 3 0,-2.035 | smd 2 x 2.8: 4 0,0.265
SOIC127P600X175-8N = smd 1.981 x 0.559: 1 -2.464,1.905; 2 -2.464,0.635; 3 -2.464,-0.635; 4 -2.464,-1.905; 5 2.464,-1.905; 6 2.464,-0.635; 7 2.464,0.635; 8 2.464,1.905
STAND-OFF = hole 3.302: 0,0

### Placement (x,y rotation side)
C1  76.96,36.13 90 top
C2  46.8,13.96 90 top
C3  53.78,12.44 90 top
C4  46.8,10.91 270 top
C5  50.65,37.75 270 top
C6  49.06,37.75 270 top
C7  58.27,36.03 90 top
C8  54.46,32.73 180 top
C9  54.46,30.57 180 top
C10  49.88,34.44 90 top
C11  25.78,39.49 270 top
C12  21.97,33.65 0 top
C13  21.97,35.81 0 top
C14  18.8,40 90 top
C15  16,39.81 0 top
C16  42.8,6.53 270 top
C17  36.32,7.42 90 top
C18  29.59,5.64 270 top
C19  31.56,5.64 270 top
C20  34.04,7.67 90 top
C21  31.56,35.3 180 top
C22  31.56,33.9 180 top
C23  34.35,33.01 0 top
C24  34.35,31.61 0 top
C25  46.16,30.03 90 top
C26  44.77,30.03 90 top
C27  34.48,13.33 180 top
C28  34.48,11.93 180 top
C29  38.93,11.42 270 top
C30  41.47,12.69 270 top
C31  35.75,35.93 90 top
C32  36.64,12.56 90 top
C33  37.15,35.93 90 top
C34  31.81,9.26 180 top
C35  31.81,10.66 180 top
C36  29.27,12.31 0 top
C37  31.81,12.31 0 top
C38  28.38,37.08 0 top
C39  15.94,33.9 180 top
C40  15.94,30.6 180 top
C41  15.94,27.3 180 top
C42  15.94,23.99 180 top
C43  15.94,20.69 180 top
C44  15.94,17.39 180 top
C45  15.94,14.22 180 top
C46  15.94,10.79 180 top
C47  15.94,7.48 180 top
C49  64.26,10.79 270 top
C50  72.07,10.86 270 top
C51  73.34,14.54 0 top
C52  63.44,15.49 90 top
C53  64.26,29.02 270 top
C54  73.85,30.29 270 top
D1  70.99,38.86 180 top
IC1  34.99,22.22 0 top
IC2  68.9,19.3 90 top
J1  77.98,43.24 180 top
J2  66.04,44.67 270 top
J3  51.05,44.51 270 top
J4  53.85,44.51 270 top
J5  25.21,7.48 90 top
J6  4.25,8.31 90 top
J7  60.39,8.31 90 top
J8  79.25,31.18 270 top
J9  47.37,4.19 0 top
J10  4.32,36.7 0 top
J11  82.55,37.59 0 top
J12  82.55,34.8 0 top
L1  72.14,33.59 0 top
L2  50.77,31.84 180 top
L3  17.91,37.58 180 top
L4  35.69,5.01 180 top
R1  49.21,9.9 180 top
R2  52.23,9.86 0 top
R3  28.38,35.68 180 top
R4  15.94,35.55 0 top
R5  15.94,32.25 0 top
R6  15.94,28.95 0 top
R7  15.94,25.65 0 top
R8  15.94,22.34 0 top
R9  15.94,19.04 0 top
R10  15.94,15.74 0 top
R11  15.94,12.44 0 top
R12  15.94,9.14 0 top
R13  15.94,5.83 0 top
R14  48.9,27.68 90 top
R15  53.28,27.68 90 top
R16  51.12,27.68 90 top
R17  48.07,23.93 0 top
R18  48.07,21.96 0 top
R19  48.07,20.5 0 top
R20  48.07,17.9 0 top
R21  70.99,40.51 0 top
S1  65.28,36.58 90 top
U1  50.36,12.44 180 top
U2  37.76,43.66 0 top
U3  54.46,36.16 180 top
U4  22.1,38.47 180 top
U5  39.5,5.9 180 top
U6  10.73,29.84 270 top
U7  10.73,17.64 270 top
U8  10.73,7.1 270 top
U9  68.14,11.43 0 top
U10  68.9,29.02 0 top
U$3  [STAND-OFF]  3.3,43.36 0 top
U$5  [STAND-OFF]  3.3,3.3 0 top
U$6  [STAND-OFF]  84.2,43.36 0 top
U$7  [STAND-OFF]  84.2,3.3 0 top

### Tracks (layer width: path | path; a pad name or v marks a point on that pad's centre or on a via)
AGND  (via drill 0.35)
  Top 0.203: U8.3 9.91,6.35 | 9.91,6.35 12.21,4.06 13.46,4.06 v13.46,4.94 | 14.45,18.29 U7.6 11.31,18.29 10.26,17.24 10.06,17.24 U7.3 4.88,16.99 4.75,17.12 3.76,17.12 3.71,17.07 2.92,17.07 | U6.6 11.4,30.24 11.2,30.24 10.15,29.19 U6.3 6.5,29.19 4.75,27.44 2.93,27.44 2.92,27.42 | U8.6 13.46,7.75 | 13.46,7.75 15.09,7.75 | C24.2 C23.2 35.94,34.02 v35.94,34.03 | C21.2 C22.2 30.66,34.22 v29.84,34.22 | 2.92,27.42 2.92,31.8 3.62,32.5 4.89,32.5 6.16,31.23 10.41,31.23 14.35,35.17 14.35,36 14.86,36.5 17.08,36.5 17.53,36.06 17.53,35.04 22.61,29.96 29.08,29.96 29.08,32.31 26.86,34.53 | 2.92,27.42 2.92,24.76 | 2.92,24.76 2.92,22.34 | 2.92,22.34 2.92,17.07 | 2.92,17.07 2.92,11.99 | 2.92,11.99 2.92,7.55 3.56,6.91 4.95,6.91 5.99,7.95 7.53,7.95 9.13,6.35 9.91,6.35 | 2.92,11.99 3.71,11.99 3.76,12.04 12.19,12.04 | 12.19,12.04 14.1,12.04 | 12.19,12.04 12.19,12.5 v12.83,13.14 | 2.92,22.34 2.93,22.36 11.1,22.36 | 11.1,22.36 v11.87,21.58 | v13.46,6.79 13.46,7.75 | v13.78,28.88 | 2.92,24.76 3.06,24.9 4.75,24.9 6.83,26.98 v8.7,26.98 | 12.74,23.99 11.1,22.36
  Top 0.508: C9.2 C8.2 52.8,32.73 51.28,34.25 51.28,35.3 | 51.28,35.3 51.28,35.91 52.47,37.1 U3.4 50.85,37.1 C5.2 C6.2 39.13,36.9 37.47,38.56 v34.29,38.56 | C12.2 C13.2 22.82,36.23 22.23,36.82 22.23,38.22 | 22.23,38.22 22.48,38.47 U4.2 25.61,38.47 | 25.61,38.47 C11.2 28.85,38.64 29.8,37.69 29.8,36.48 C21.2 | 22.23,38.22 21.84,38.6 21.84,39.86 21.13,40.58 C14.2 17.62,40.58 C15.2 | 39.5,5.52 39.88,5.9 U5.2 40.85,5.95 C16.2 | 39.5,5.52 39.5,7.04 | 39.5,7.04 38.54,8 C17.2 34.98,8 34.46,8.53 C20.2 33.92,8.41 31.8,8.41 31.23,8.97 C34.2 C35.2 | 26.86,34.53 26.86,37.23 25.61,38.47 | C10.2 51.28,35.29 51.28,35.3 | 39.5,5.52 39.24,5.26 39.24,4.51 38.08,3.34 | 38.08,3.34 33.95,3.34 32.49,4.79 C19.2 C18.2 13.61,4.79 v13.46,4.94 | R2.2 52.48,9.54 52.48,9.25 52.24,9.01 41.47,9.01 39.5,7.04 | J9.1 46.52,3.34 38.08,3.34
  Top 0.813: C34.2 30.29,9.26 30.11,9.07 29.52,9.07 v29.46,9.02
  Bottom 0.203: v12.83,13.14 13.91,14.22 v14.29,14.22 | v11.87,21.58 12.76,20.69 v13.84,20.69 13.78,20.76 v13.78,28.88 | v13.46,4.94 v13.46,6.79 | v13.78,28.88 11.87,26.98 v8.7,26.98 | v13.78,28.88 13.78,32.82 v14.22,33.27
  Bottom 0.508: v34.29,38.56 32.32,36.59 32.32,34.22
  Bottom 0.813: v29.84,34.22 32.32,34.22 35.75,34.22 v35.94,34.03 35.36,33.44 35.36,32.17 35.37,32.15 35.37,31.39 34.39,30.41 34.39,12.45 28.78,12.45 27.88,11.55 27.3,11.55 | 27.3,11.55 24.13,11.55 17.53,4.94 v13.46,4.94 | v29.46,9.02 29.31,9.02 29.1,8.8 28.3,8.8 27.3,9.8 27.3,11.55
  pour Bottom: 35.05,41.91 37.72,41.91 40.89,38.73 53.34,38.73 53.47,38.86 54.74,37.59 59.82,37.59 59.82,35.18 58.67,34.04 56.13,34.04 56.13,29.84 55.88,29.59 50.04,29.59 47.5,32.13 47.5,35.69 35.05,35.69
  pour Top: 0.89,48.9 35.69,48.9 35.69,38.73 53.59,38.73 54.74,37.59 59.82,37.59 59.82,35.18 58.67,34.04 56.13,34.04 56.13,29.72 55.88,29.46 50.04,29.46 47.5,32 47.5,35.69 37.85,35.69 37.85,12.45 41.27,12.45 43.18,10.54 43.18,-2.16 42.16,-3.17 -2.41,-3.17 -2.41,45.59
  pour Bottom: -2.41,45.59 0.89,48.9 35.81,48.9 35.81,38.73 35.81,35.81 35.94,35.69 37.85,35.69 37.85,12.45 41.15,12.45 43.18,10.67 43.18,10.54 43.18,-2.16 42.16,-3.17 -2.41,-3.17
AVDD  (via drill 0.35)
  Top 0.203: IC1.21 IC1.22 33.74,15.12 31.23,12.62 31.23,12.37 C37.1 | IC1.19 32.24,15.4 29.91,13.07 29.02,13.07 28.69,12.75 C36.1 | IC1.59 33.74,29.94 32.14,31.54 C22.1 C21.1 | IC1.56 35.24,30.28 36.32,31.36 v36.32,32.57 | IC1.54 36.24,29.88 37.91,31.55 v37.91,32.57
  Top 0.254: C21.1 v33.14,35.3
  Top 0.305: C36.1 28.7,12.3 v28.7,9.77 28.72,9.79 29.81,9.79 30.21,10.19 30.21,11.28 C37.1 31.23,12.37
  Top 0.508: L4.2 34.79,6.07 C20.1 33.12,7.75 30.38,7.75 29.92,8.2 29.13,8.2 28.65,8.68 28.65,9.35 28.7,9.4 v28.7,9.77
  Bottom 0.305: v28.7,9.77 29.22,9.77 29.23,9.76 36.03,9.76 36.73,9.06 36.79,9.06 39.62,6.22 50.42,6.22 J9.3
  Bottom 0.813: v33.14,35.3 36.04,35.3 36.91,34.42 | v37.91,32.57 36.48,31.14 | 36.48,31.14 35.36,30.01 35.36,11.48 29.18,11.48 28.56,10.87 28.56,10.07 28.7,9.93 v28.7,9.77 | 37.91,33.01 37.91,33.42 36.91,34.42 | 37.91,33.01 v37.91,32.57 | v36.32,32.57 v37.91,32.57 | v36.32,32.57 36.48,32.41 36.48,31.14 | v36.32,32.57 36.77,33.01 | 36.77,33.01 37.91,33.01 | 36.77,33.01 36.91,33.15 36.91,34.42
AVSS  (via drill 0.35)
  Top 0.203: C30.2 41.37,12.11 38.98,9.72 C29.2 38.92,9.7 C32.1 36.58,11.93 35.18,11.93 C28.1 C27.1 35.24,13.51 IC1.25 | C35.1 C34.1 | IC1.23 34.24,14.86 33.41,14.03 33.37,14.03 32.39,13.05 C37.2 | C36.2 32.74,15.2 IC1.20 | 33.77,31.49 C24.1 C23.1 33.77,35.35 34.93,36.51 C31.2 C33.2 37.9,36.51 38.54,35.87 38.54,31.68 36.74,29.88 IC1.53 | 33.77,31.49 33.77,30.67 34.23,30.22 34.23,27.97 IC1.58 IC1.57 34.74,30.52 33.77,31.49 | IC1.32 38.74,15.67 39.37,15.04 v42.48,15.04
  Top 0.305: 35.18,11.93 34.63,11.38 34.63,11.35 33.94,10.66 C35.1 C37.2 | v29.53,10.47 29.53,11.98 C36.2
  Top 0.406: C33.2 v37.15,37.77
  Top 0.508: L3.2 17.01,37.95 C15.1 15.23,39.81 16.83,41.41 29.96,41.41 33.59,37.77 35.75,37.77 | 35.75,37.77 v37.15,37.77 | C31.2 35.75,37.77
  Top 0.813: v37.02,9.77 38.92,9.77 38.98,9.72
  Bottom 0.305: v37.02,9.77 39.93,6.86 52.32,6.86 J9.4
  Bottom 0.508: v42.48,15.04 43.69,13.84 43.69,11.93 41.53,9.77 v37.02,9.77
  Bottom 0.813: v37.15,37.77 37.15,35.55 38.88,33.82 38.88,32.17 36.32,29.61 36.32,10.47 | 36.32,10.47 v37.02,9.77 | 36.32,10.47 v29.53,10.47
BYPASS
  Top 0.508: U1.4 C2.1
DGND  (via drill 0.35)
  Top 0.203: IC1.41 40.82,22.56 41.57,22.56 41.6,22.6 v44.01,22.6 | IC1.31 38.24,15.54 39.35,14.42 40.21,14.42 40.22,14.41 42.22,14.41 | 42.22,14.41 42.74,14.41 44.01,15.67 44.01,17.01 | 42.21,14.42 42.22,14.41
  Top 0.254: IC1.49 38.74,28.63 40.71,30.61 C26.2 | IC1.51 37.74,29.54 v40.45,32.25 | IC1.33 41.1,18.09 v42.93,18.09
  Top 0.305: U10.4 66.43,23.39 IC2.11 66.54,22.23 67.06,21.72 67.06,17.59 66.5,17.03 IC2.19 64.39,17.03 C52.2 63.01,15.64 62.86,15.64 62.68,15.46 62.68,14.68 v62.23,14.22 | J9.6 60.07,7.99 J7.1
  Top 0.508: R1.2 48.47,10.06 C4.2 | C26.2 C25.2 v46.16,32.25 | v42.93,18.09 44.01,17.01 51.69,17.01 J7.1 | U10.4 65.59,27.11 C53.2 63.51,28.44 62.99,28.96 63.02,28.98 S1.1
  Top 0.813: v42.93,18.09 42.93,15.92 43.42,15.43 43.42,11.25 44.58,10.09 46.77,10.09 C4.2
  Bottom 0.203: v44.01,22.6 v44,22.6 42.93,22.6
  Bottom 0.508: J7.1 62.23,10.15 v62.23,14.22
  Bottom 0.813: v46.16,32.25 v40.45,32.25 42.93,29.77 42.93,22.6 v42.93,18.09
  pour Bottom: 38.35,13.08 41.53,13.08 43.56,11.05 43.94,10.67 43.94,7.62 43.94,-1.02 44.96,-2.03 46.74,-3.81 53.59,-3.81 61.21,-3.81 61.34,-3.68 62.99,-2.03 62.99,4.95 62.99,12.19 68.45,17.65 68.45,23.88 68.45,31.5 66.8,31.5 65.91,32.38 65.91,34.54 63.75,36.7 61.85,36.7 58.8,33.66 57.15,33.66 57.02,33.53 56.64,33.15 56.64,29.08 49.78,29.08 48.64,30.23 47.12,31.75 47.12,35.31 38.99,35.31 38.35,35.31
  pour Top: 38.35,35.31 38.35,13.21 38.48,13.08 41.4,13.08 43.94,10.54 43.94,8.38 43.94,-1.02 46.74,-3.81 48.9,-3.81 61.21,-3.81 62.99,-2.03 62.99,12.19 65.02,14.22 68.45,17.65 68.45,18.54 68.45,28.32 68.45,31.5 65.91,31.5 65.91,34.67 64.01,36.58 61.85,36.58 58.93,33.66 57.78,33.66 56.64,33.66 56.64,29.08 49.78,29.08 47.12,31.75 47.12,35.31
DVDD  (via drill 0.35)
  Top 0.203: IC1.52 37.24,29.74 39.43,31.93 39.43,33.01 | 41.47,31.74 41.27,31.55 40.64,31.55 38.24,29.15 IC1.50 | C25.1 46.65,29.93 46.72,29.93 46.87,30.08 46.87,32.44 46.43,32.88 45.9,32.88 45.65,32.63 41.47,32.63
  Top 0.254: IC1.48 41.29,25.97 C26.1
  Top 0.305: 64.96,16.38 IC2.20 63.81,14.91 C52.1
  Top 0.508: C4.1 46.8,11.5 U1.5 | C26.1 C25.1 47.71,29.45 R14.2 R16.2 R15.2 57.48,28.26 J7.10 61.67,32.45 61.67,33.88 62.46,34.67 63.58,34.67 64.36,33.88 64.36,32.77 64.26,32.67 C53.1 | v63.44,13.91 C52.1 | C53.1 64.59,29.27 64.88,29.27 65.77,28.38 U10.3 | C53.1 65.59,30.92 U10.1
  Top 0.813: 39.43,33.01 39.88,33.46 | 39.88,33.46 40.64,33.46 41.47,32.63 41.47,31.74 | 39.88,33.46 40.32,33.9 v40.32,34.79 | v45.66,11.8 46.76,11.8 C4.1
  Bottom 0.305: J9.5 57.53,5.46 59.43,7.36
  Bottom 0.508: v63.44,13.91 63.44,9.45 60.95,6.96 59.83,6.96 59.43,7.36 59.04,7.75 59.04,8.39 56.57,10.87 53.42,10.87 52.48,11.8 v45.66,11.8
  Bottom 0.813: v40.32,34.79 41.9,33.22 46.56,33.22 48.01,31.77 48.01,16.69 45.66,14.34 v45.66,11.8
GND  (via drill 0.35)
  Top 0.254: D1.C 71.01,39.76 71.01,41.13 73.13,43.24 J1.P1
  Top 0.508: 50.35,11.93 50.35,10.46 R1.1 49.83,9.86 R2.1 | 50.35,11.93 50.86,12.44 U1.2 | 50.35,11.93 50.35,14.09 | C2.2 49.9,14.54 50.35,14.09 | C3.2 52.71,14.09 51.31,14.09 | 51.31,14.09 50.35,14.09 | v51.31,15.49 51.31,14.09
  Top 0.61: J11.1 79.61,37.59 79.3,37.28
  Top 0.813: C1.2 76.96,34.94 79.3,37.28 79.3,44.24 78.97,44.56 76.98,44.56 75.66,43.24 J1.P1
  Bottom 0.813: v51.31,15.49 51.31,20.76 50.5,21.57 50.5,26.29 51.05,26.84 51.98,26.84 57.81,32.67 61.55,32.67 62.4,31.83 73.91,31.83 C1.2 | J4.2 55.12,43.24 J1.P1
GND-ISO
  Top 0.305: 74.68,26.61 72.52,24.45 IC2.10 71.38,22.23 71.03,21.88 71.03,17.49 71.49,17.03 IC2.2 74.17,17.03 | 74.68,26.61 75.34,27.27 | 75.34,27.27 J8.1 | 74.68,26.62 74.68,26.61 | 74.51,28.06 74.56,28.06 75.34,27.27 | 79.76,9.56 78.65,9.56 76.33,11.89 76.33,15.94 75.24,17.03 74.17,17.03 | C51.2 74.17,14.79 74.17,17.03
  Top 0.406: 64.77,38.2 64.74,38.23 J2.GND 64.83,42.03 64.83,42.81 66.04,44.02 J2.SHIELD3
  Top 0.508: C50.2 70.39,8.33 70.39,8.26 70.15,8.03 67.62,8.03 67.62,8.06 U9.2 65.74,9.95 C49.2 | U10.7 71.42,29.71 C54.2 73.85,29.37 74.51,28.71 74.51,28.06 73.56,27.11 U10.5
  Top 0.813: U2.1 41.71,39.7 53.71,39.7 55.22,38.2 64.77,38.2 | J8.1 79.25,30.76 80.75,29.26 80.75,7.7 79.87,6.82 78.63,6.82 75.44,10.01 C50.2 | J2.SHIELD2 J2.SHIELD3 J2.SHIELD1
  Bottom 0.61: J11.2 84.53,37.59 83.13,38.99 81.97,38.99 81.59,38.61 79.25,38.61
  Bottom 0.813: U2.1 38.44,43.66 39.75,44.98 45.92,44.98 50.42,40.48 54.47,40.48 55.4,41.4 76.45,41.4 79.25,38.61 J8.1
  pour Bottom: 63.63,12.06 63.63,-0.25 63.5,-0.51 63.63,-0.64 87.5,-0.64 88.9,0.76 88.9,46.35 87.88,47.37 81.92,47.37 80.14,45.59 80.14,36.45 74.68,30.99 69.09,30.99 69.09,17.4 63.75,12.06
  pour Top: 68.96,30.99 74.8,30.99 75.44,31.62 80.14,36.32 80.14,37.34 80.14,45.47 82.04,47.37 87.88,47.37 88.9,46.35 88.9,0.76 87.5,-0.64 63.88,-0.64 63.63,-0.38 63.63,1.4 63.63,11.94 64.39,12.7 68.58,16.89 68.71,16.89 68.96,17.14
ISO_PWD  (via drill 0.35)
  Top 0.203: U10.6 v73.72,28.38
  Bottom 0.203: v73.72,28.38 78.99,28.38 J8.2
N$1
  Top 0.813: U2.4 50.2,43.66 J3.1
N$2
  Top 0.813: U2.3 44.53,41.97 J3.2
N$3
  Top 0.508: U3.5 53.87,34.51 57.32,34.51 C7.1
N$4
  Top 0.508: C7.2 57.78,37.1 U3.3
N$5
  Top 0.508: U3.1 54.65,35.22 53.96,35.91 52.36,35.91 52.12,35.67 52.12,34.77 53.04,33.85 54.19,33.85 C8.1 C9.1 55.23,30.57 54.32,29.66 52.89,29.66 52.65,29.9 52.65,30.86 L2.1
N$6
  Top 0.508: U5.4 C17.1
N$7
  Top 0.508: C12.1 C13.1 20.8,36.12 U4.5 18.86,37.53 L3.1
N$8
  Top 0.508: U4.4 C14.1
N$9
  Top 0.508: U5.5 38.15,5.01 L4.1 36.36,5.01 35.35,4 34.22,4 31.73,6.49 C19.1 C18.1
N$10
  Top 0.203: C28.2 C27.2 33.9,14.02 34.74,14.85 IC1.24
N$11
  Top 0.203: IC1.18 31.74,15.4 29.76,13.43 28.58,13.43 28,12.86 28,9.26 26.23,7.48 J5.1
N$12  (via drill 0.35)
  Top 0.203: J5.2 25.21,11.93 | 25.21,11.93 27.06,13.78 29.53,13.78 31.24,15.49 IC1.17 | R13.2 16.64,5.96 | 25.21,11.93 19.24,5.96 17.78,5.96 | 16.64,5.96 17.78,5.96 | C39.2 15.84,33.42 15.84,33.34 16.04,33.15 v17.78,33.15 | v17.78,6.73 17.78,5.96 | C47.2 15.36,7.25 16.64,5.96 | C40.2 16.11,29.84 v17.78,29.84 | C41.2 15.84,26.82 15.84,26.74 16.04,26.54 v17.78,26.54 | C42.2 15.84,23.51 15.84,23.44 16.16,23.11 v17.78,23.11 | C43.2 15.84,20.21 15.84,20.14 16.16,19.81 v17.78,19.81 | C44.2 15.84,16.91 15.84,16.84 16.16,16.51 v17.78,16.51 | C45.2 16.24,13.34 v17.78,13.34 | C46.2 15.84,10.31 15.84,10.23 16.04,10.03 v17.78,10.03
  Bottom 0.203: v17.78,33.15 v17.78,29.84 v17.78,26.54 v17.78,23.11 v17.78,19.81 v17.78,16.51 v17.78,13.34 v17.78,10.03 v17.78,6.73
N$13
  Top 0.203: C38.2 R3.1 28.96,33.89 32.74,30.12 IC1.61
N$14
  Top 0.203: R4.2 C39.1 18.1,33.9 22.54,29.46 32.26,29.46 | C38.1 R3.2 27.8,34.35 32.26,29.9 32.26,29.46 | 32.26,29.46 32.26,27.97 IC1.62
  Top 0.254: IC1.63 IC1.62
N$15
  Top 0.203: C40.1 R5.2 19.11,32.25 25.9,25.47 IC1.2
N$16
  Top 0.203: C41.1 R6.2 21.4,28.95 25.88,24.47 IC1.4
N$17
  Top 0.203: C42.1 R7.2 23.81,25.64 25.99,23.47 IC1.6
N$18
  Top 0.203: C43.1 R8.2 22.54,22.34 22.67,22.47 IC1.8
N$19
  Top 0.203: C44.1 R9.2 22.54,19.04 24.97,21.47 IC1.10
N$20
  Top 0.203: C45.1 R10.2 21.27,15.74 26,20.47 IC1.12
N$21
  Top 0.203: C46.1 R11.2 19.37,12.44 26.4,19.47 IC1.14
N$22
  Top 0.203: C47.1 R12.2 17.97,9.14 27.3,18.47 IC1.16
N$23
  Top 0.203: IC1.43 45.19,23.47 45.66,23.93 R17.1
N$24
  Top 0.203: IC1.40 R18.1
N$25
  Top 0.203: IC1.39 44.88,21.47 45.85,20.5 R19.1
N$26
  Top 0.203: IC1.34 44.46,18.97 45.53,17.9 R20.1
N$27
  Top 0.254: D1.A 71.42,38.86 70.64,38.08 69.59,38.08 69.34,38.33 69.34,39.39 70.14,40.2 R21.1
NVCC  (via drill 0.35)
  Top 0.508: C11.1 25.49,40.34 24.56,39.41 U4.3 23.39,40.35 v23.37,40.38 | U4.1 24.69,37.53 v24.7,37.52 | v48.13,34.41 48.95,33.59 C10.1 49.88,31.85 L2.2
  Bottom 0.508: v24.7,37.52 24.7,39.04 v23.37,40.38
  Bottom 0.813: v48.13,34.41 42.07,34.41 36.98,39.5 24.25,39.5 v23.37,40.38
P_BIAS
  Top 0.203: R4.1 10.29,30.49 U6.1 4.94,30.49 J6.10
  Bottom 0.203: J6.10 6.86,33.77 J10.2
P_IN1
  Top 0.203: R12.1 12,9.14 10.62,7.75 U8.1 6.71,10.85 J6.2
P_IN2
  Top 0.203: R11.1 15.18,12.44 12.51,15.1 12.51,16.14 U7.4 11.16,16.99 10.37,16.21 7.07,16.21 J6.3
P_IN3
  Top 0.203: R10.1 14.41,15.74 12.51,17.64 U7.5 11.3,17.64 10.22,16.57 6.93,16.57 6.29,15.93 J6.4
P_IN4
  Top 0.203: R9.1 15.02,18.7 11.22,18.7 10.16,17.64 U7.2 5.08,17.64 J6.5
P_IN5
  Top 0.203: R8.1 13.86,22.34 U7.1 6.97,18.29 J6.6
P_IN6
  Top 0.203: R7.1 15.19,25.64 U6.4 11.16,29.19 9.4,27.43 9.4,24.89 8.06,23.55 J6.7
P_IN7
  Top 0.203: R6.1 14.47,29.84 U6.5 11.3,29.84 10.16,28.69 6.86,28.69 J6.8
P_IN8
  Top 0.203: R5.1 14,30.89 11.22,30.89 10.16,29.84 U6.2 5.46,29.84 J6.9
  Bottom 0.203: J6.9 4.25,29.48 3.06,30.68 3.06,31.66 3.76,32.36 3.79,32.36 4.32,32.89 J10.1
P_REF
  Top 0.203: R13.1 11.49,5.83 11.28,6.05 11.22,6.05 10.16,7.1 U8.2 9.27,7.1 8.06,8.31 J6.1
PWD  (via drill 0.35)
  Top 0.203: IC1.35 44.79,19.47 45.66,18.6 50.55,18.6 55.18,18.6 J7.3 63.06,13.39 63.17,13.27 63.7,13.27 63.76,13.34 64.52,13.34 68.16,16.98 68.16,28.8 67.31,29.65 U10.2 | R16.1 51.62,26.59 51.69,26.59 v52.39,25.9
  Bottom 0.203: J7.3 54.42,19.36 54.42,23.87 v52.39,25.9
RST  (via drill 0.35)
  Top 0.203: IC1.36 44.8,19.97 45.8,18.96 50.69,18.96 | 50.69,18.96 50.7,18.95 50.8,18.95 | 50.69,18.96 57.36,18.96 J7.4 | IC2.13 63.96,20.93 v63.94,20.91 | R15.1 53.28,25.96 v53.34,25.9 | v57.4,29.97 61.16,33.73 61.16,34.09 62.38,35.31 65.56,35.31 S1.3
  Bottom 0.203: v63.94,20.91 63.94,19.91 64.58,19.28 64.58,17.39 64.21,17.02 61.48,17.02 J7.4 56.52,19.8 56.52,22.72 v53.34,25.9 v57.4,29.96 v57.4,29.97
SPI_CLK  (via drill 0.35)
  Top 0.203: R18.2 50.26,23.57 51.84,23.57 52.44,24.18 59.76,24.18 J7.7 | IC2.18 63.97,17.68 v63.94,17.65
  Bottom 0.203: v63.94,17.65 61.26,17.65 60.88,17.28 59.57,17.28 59.56,17.27 56.9,19.93 56.9,22.04 58.41,23.55 J7.7
SPI_CS  (via drill 0.35)
  Top 0.203: R19.2 48.71,20.44 51.44,20.44 v52.2,21.2 60.2,21.2 J7.6 | IC2.15 65.25,19.65 v62.48,19.65 | R14.1 50.09,25.9 v51.44,25.9
  Bottom 0.203: v62.48,19.65 61.75,19.65 J7.6 | v51.44,25.9 52.2,25.14 v52.2,21.2
SPI_DRDY
  Top 0.203: IC2.12 64.61,21.58 63.31,22.88 63.31,25.71 J7.9 60.39,28.59 56.69,24.89 45.72,24.89 45.15,25.47 IC1.47
SPI_ISO_CLK
  Top 0.305: J8.9 76.96,13.14 76.96,16.19 75.47,17.68 IC2.3
SPI_ISO_CS
  Top 0.305: J8.6 78.04,18.48 76.89,19.63 IC2.6
SPI_ISO_DRDY
  Top 0.305: J8.3 74.73,21.58 IC2.9
SPI_ISO_MISO
  Top 0.305: IC2.5 76.21,18.98 J8.7
SPI_ISO_MOSI
  Top 0.305: IC2.4 75.59,18.33 78,15.91 78,15.42 79.25,14.18 J8.8
SPI_ISO_RST
  Top 0.305: J8.4 76.62,20.93 IC2.8
SPI_ISO_START
  Top 0.305: J8.5 78.51,20.28 IC2.7
SPI_MISO  (via drill 0.35)
  Top 0.203: R17.2 51.69,23.93 52.3,24.54 56.84,24.54 58.39,26.09 J7.8 | IC2.16 63.98,18.98 v63.94,19.02
  Bottom 0.203: v63.94,19.02 63.12,19.84 63.12,19.91 61.66,21.37 61.66,24.82 J7.8
SPI_MOSI  (via drill 0.35)
  Top 0.203: R20.2 53.34,17.9 J7.2 | IC2.17 63.73,18.33 62.29,16.89 v62.29,16.12
  Bottom 0.203: v62.29,16.12 61.58,15.42 61.58,12.9 60.39,11.7 J7.2
SPI_START
  Top 0.203: IC1.38 44.88,20.97 46.05,19.8 49.18,19.8 49.19,19.8 59.05,19.8 J7.5 62.2,20.28 IC2.14
VBAT  (via drill 0.35)
  Top 0.508: U1.1 52.34,11.5 | 52.34,11.5 52.69,11.85 52.69,13.02 52.34,13.38 U1.3 | C16.1 42.11,7.11 41.78,6.79 40.84,6.79 U5.3 | C6.1 C5.1 53.67,38.6 54.71,37.56 54.71,36.54 55.09,36.16 U3.2 56.99,36.16 v57.01,36.18 | 52.34,11.5 53.42,11.5 C3.1 53.64,11.71 53.64,9.25 52.74,8.35 44.03,8.35 C16.1 | C16.1 43.09,7.11 43.66,6.54 43.66,6.1 | 43.66,6.1 43.66,5.36 43.25,4.96 U5.1 | 43.66,6.1 48.01,6.1 J9.2
  Top 0.813: v72.9,35.31 73.04,35.17 L1.2 76.83,37.38 C1.1 | v55.12,11.68 54.94,11.86 C3.1
  Bottom 0.508: v57.01,36.18 57.18,36.01 57.18,33.63
  Bottom 0.813: 50.29,15.75 50.3,15.75 50.34,15.7 | 50.34,15.7 50.34,15.09 53.75,11.68 v55.12,11.68 | 50.34,15.7 50.34,20.36 49.53,21.18 49.53,26.69 50.65,27.8 51.35,27.8 57.18,33.63 58.85,35.31 v72.9,35.31
VBATPRE
  Top 0.254: R21.2 73.53,38.83 73.56,38.83
  Top 0.61: J12.1 78.69,34.8 76.43,32.53 72.45,32.53 71.39,33.59 L1.1
  Top 0.813: J1.P2 73.56,38.83 71.24,36.5 L1.1
  Bottom 0.813: J4.1 74.39,44.51 74.44,44.56 76.66,44.56 J1.P2
VCAP1
  Top 0.203: IC1.28 36.74,15.26 38.82,13.18 C29.1
VCAP2
  Top 0.203: IC1.30 37.74,15.4 39.08,14.07 40.06,14.07 40.85,13.27 C30.1
VCAP3
  Top 0.203: C31.1 C33.1 37.15,31.3 36.76,30.91 35.74,29.88 IC1.55 35.75,27.97
VCAP4
  Top 0.203: C32.2 36.64,13.58 35.74,14.48 IC1.26
VCC-ISO  (via drill 0.35)
  Top 0.406: J2.VBUS 67.34,41.86 68.83,40.36 68.83,38.1 v67.31,36.58
  Top 0.508: C49.1 68.08,11.64 U9.4 U9.3
  Top 0.61: 68.82,32 71.9,32 72.13,31.77 76.74,31.77 77.55,32.58 82.87,32.58 J12.2
  Top 0.813: U9.4 68.14,16.02 68.82,16.71 68.82,32 68.82,32.49 69.04,32.7 69.04,34.85 v67.31,36.58
  Bottom 0.813: U2.2 40.3,43.61 45.2,38.71 62.02,38.71 62.4,38.33 65.56,38.33 v67.31,36.58
VCCIO
  Top 0.305: C50.1 72.14,11.71 | 72.14,11.71 75.86,11.71 J8.10 | 72.14,11.71 72.14,13.91 C51.1 72.76,16.14 IC2.1
  Top 0.406: IC2.1 71.31,16.38 70.02,17.68 70.02,30.08 70.8,30.87 71.42,30.87
  Top 0.508: C50.1 69.64,9.27 U9.1 | C54.1 71.42,30.87 U10.8

### Text on the board
tPlace: EEG-FrontOnly PCB | DC_ISO | + | DC_ISO | CONN | USB_PWR | BAT_PWR | GROUND | RST | PWR_LED | RLD-CH8 | POWER | RLD | VDD | GND | ISO | USB | CH8 | DRDY | PWD | CH7 | MISO | DRDY | LEADS_CONN | CH6 | SCLK | RST | CH5 | CS | START | CH4 | START | CS | ADS1299-IPAGR | * | CH3 | RST | MISO | CH2 | PWD | MOSI | * | CH1 | MOSI | SCLK | REF | DGND | VCC | AGND | VBAT | AVDD | AVSS | DVDD | DGND | ISO-PINS | ISOLATED / PWR PINS | ISOLATION / BARRIER